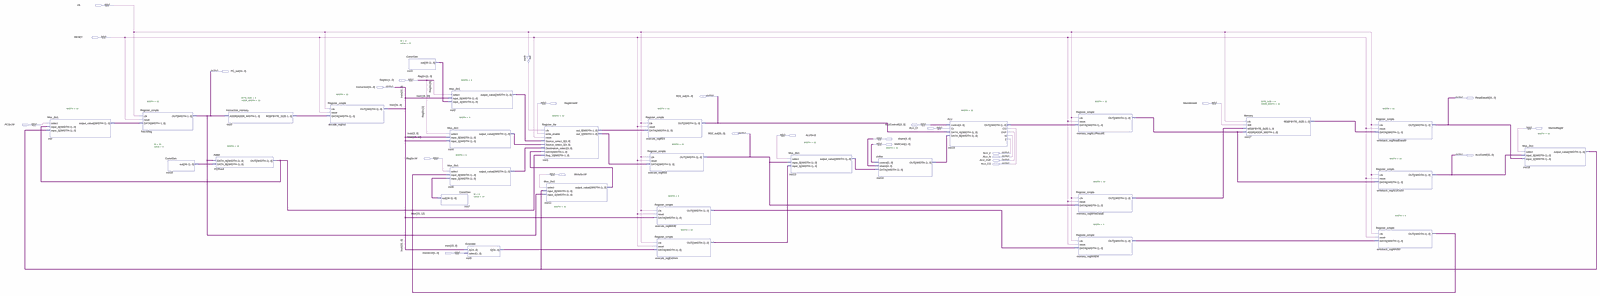
[diagram p0: schematic sheet, whole]
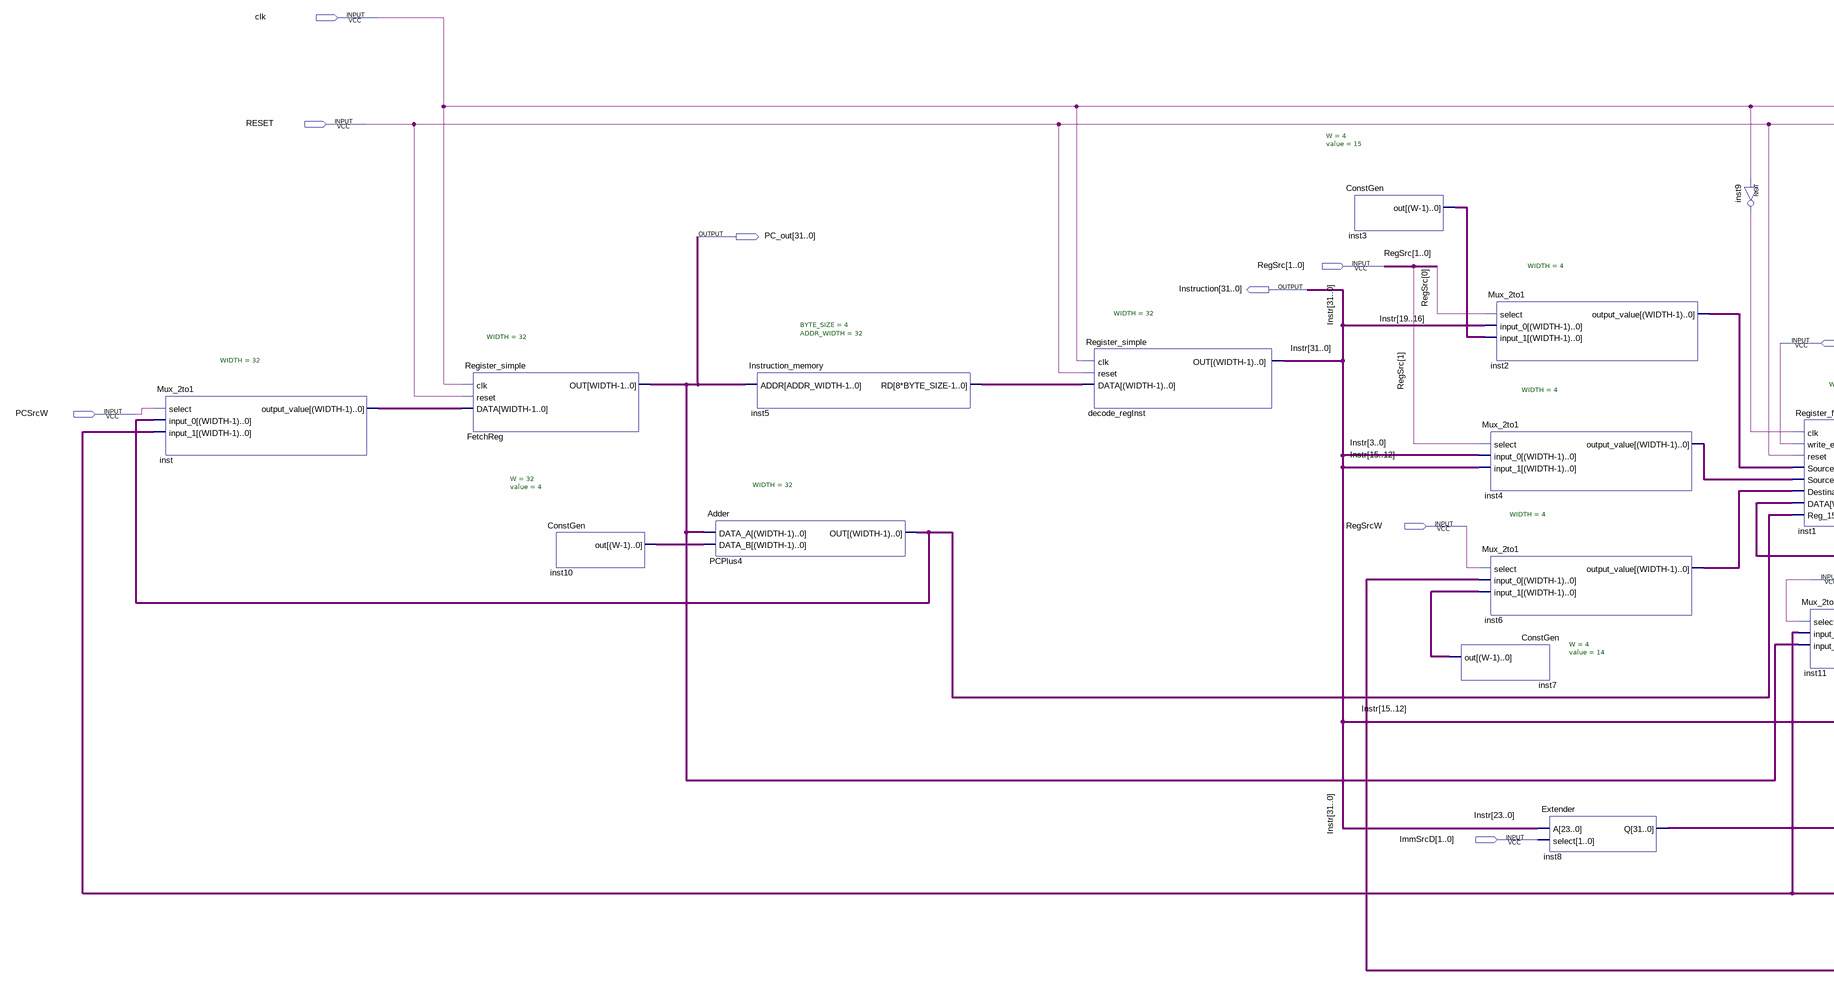
[diagram p1: schematic sheet, left part]
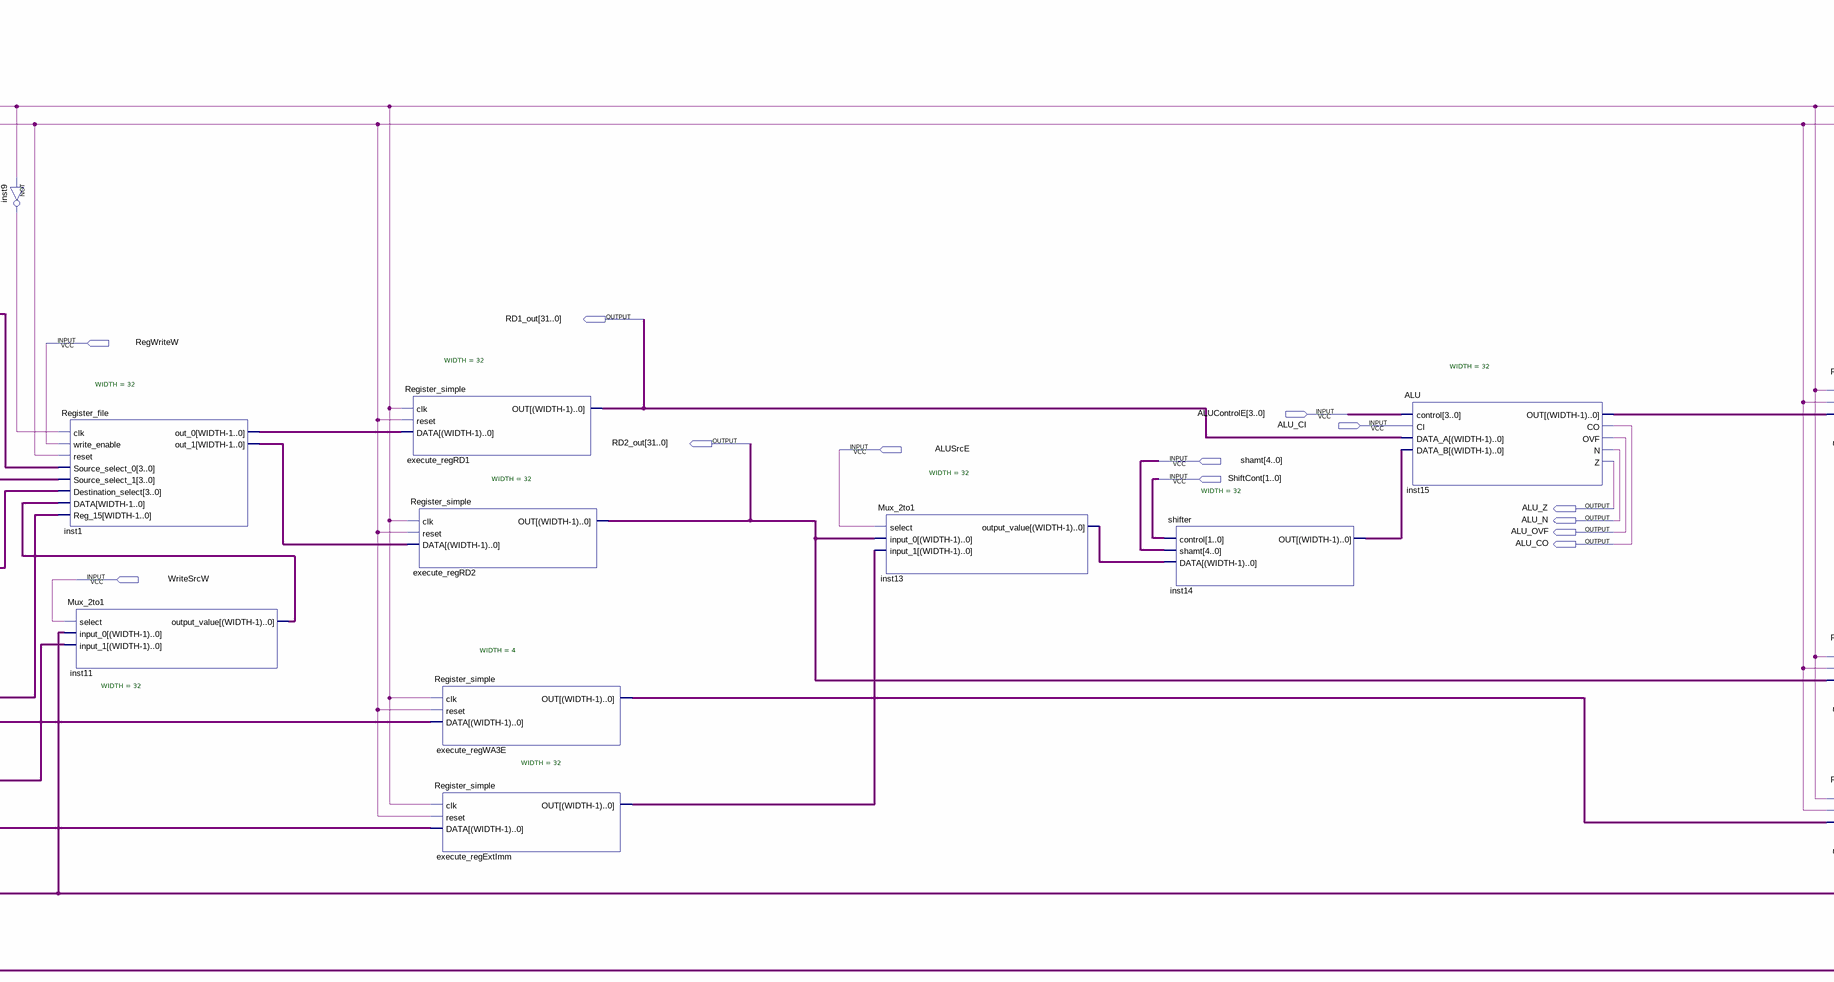
[diagram p2: schematic sheet, centre part]
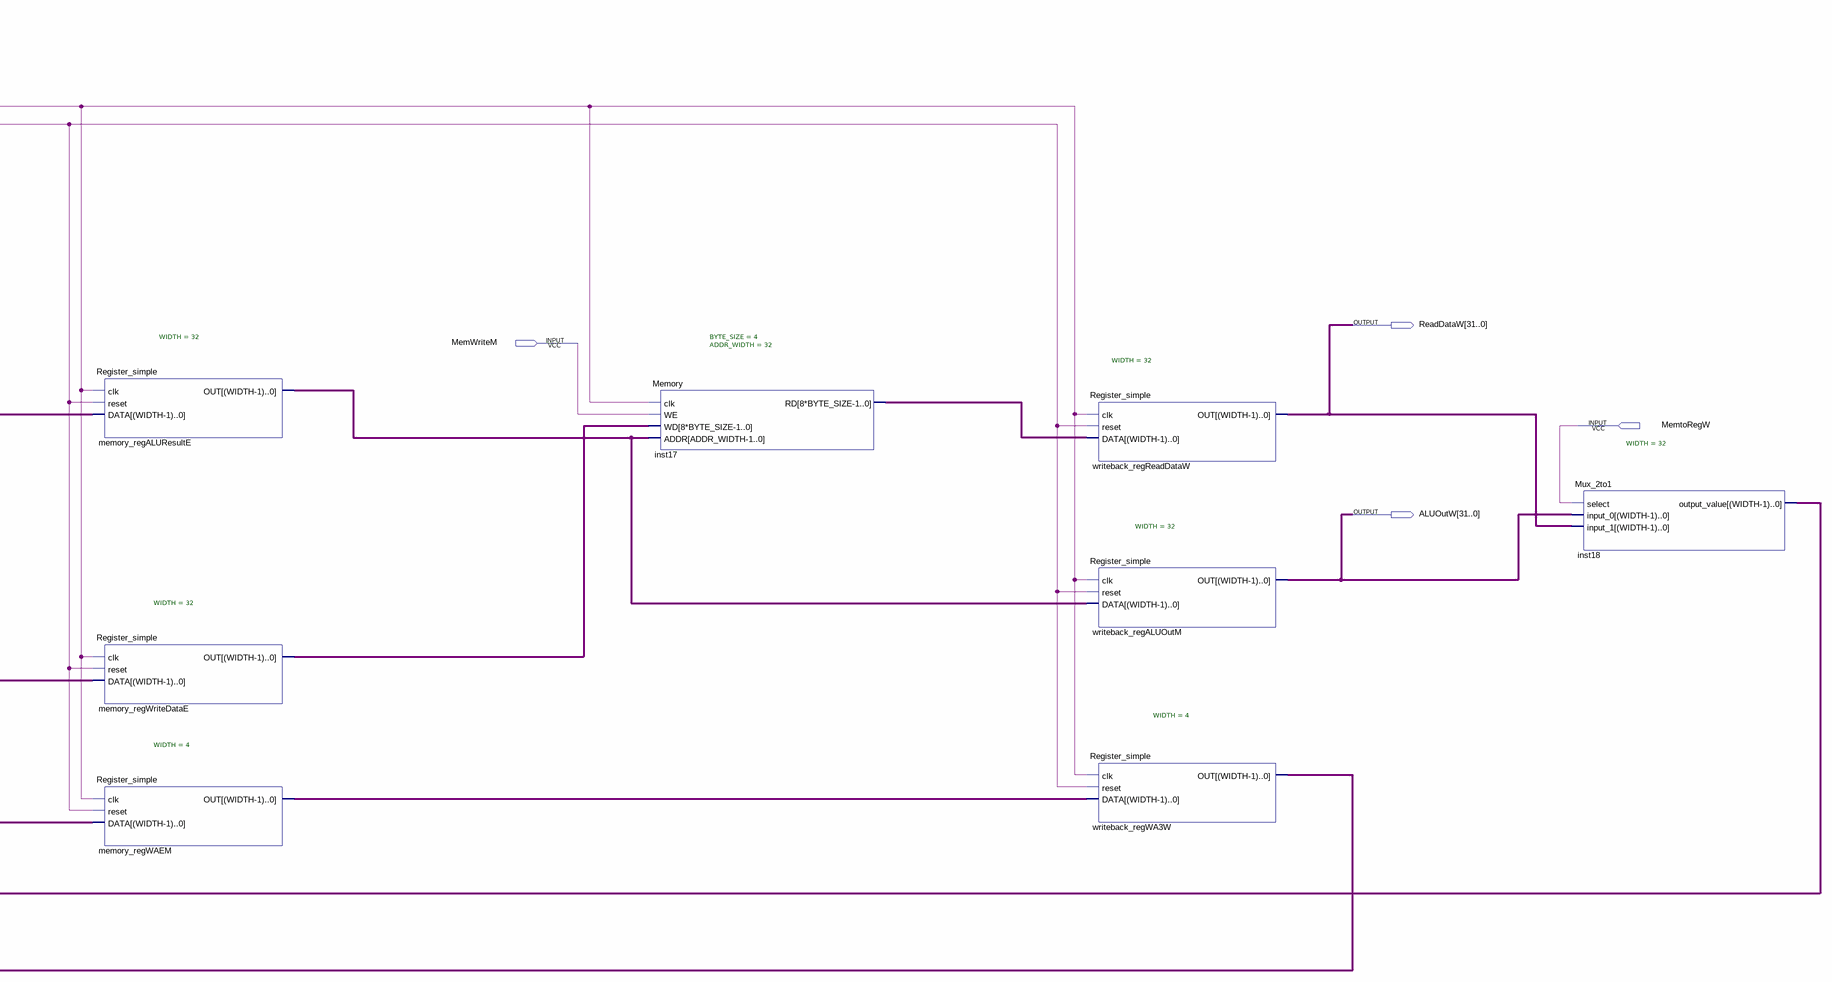
[diagram p3: schematic sheet, right part]
// Quartus schematic datapath.bdf as structural Verilog: 30 symbols, 25 pins
module datapath (
  input  clk,
  input  RESET,
  input  [1:0] RegSrc,
  input  RegWriteW,
  input  MemWriteM,
  input  PCSrcW,
  input  [3:0] ALUControlE,
  input  ALU_CI,
  input  MemtoRegW,
  input  ALUSrcE,
  input  [4:0] shamt,
  input  [1:0] ShiftCont,
  input  RegSrcW,
  input  WriteSrcW,
  input  [1:0] ImmSrcD,
  output [31:0] PC_out,
  output [31:0] Instruction,
  output [31:0] RD1_out,
  output [31:0] ReadDataW,
  output [31:0] RD2_out,
  output ALU_Z,
  output [31:0] ALUOutW,
  output ALU_N,
  output ALU_OVF,
  output ALU_CO
);

  wire inst9_out;
  wire [3:0] execute_regWA3E_out, inst2_output_value, inst3_out, inst4_output_value, inst6_output_value,
       inst7_out, memory_regWAEM_out, writeback_regWA3W_out;
  wire [31:0] execute_regExtImm_out, inst1_out_0, inst1_out_1, inst5_rd, inst8_q, inst10_out,
       inst11_output_value, inst13_output_value, inst14_out, inst15_out, inst17_rd, inst18_output_value,
       inst_output_value, memory_regALUResultE_out, memory_regWriteDataE_out, PCPlus4_out;

  Mux_2to1 #(.WIDTH(32)) inst (
    .select(PCSrcW), .input_0(PCPlus4_out), .input_1(inst18_output_value), .output_value(inst_output_value));
  Register_simple #(.WIDTH(32)) FetchReg (.clk(clk), .reset(RESET), .DATA(inst_output_value), .OUT(PC_out));
  ConstGen #(.W(32), .value(4)) inst10 (.out(inst10_out));
  Adder #(.WIDTH(32)) PCPlus4 (.DATA_A(PC_out), .DATA_B(inst10_out), .OUT(PCPlus4_out));
  Instruction_memory #(.BYTE_SIZE(4), .ADDR_WIDTH(32)) inst5 (.ADDR(PC_out), .RD(inst5_rd));
  Register_simple #(.WIDTH(32)) decode_regInst (.clk(clk), .reset(RESET), .DATA(inst5_rd), .OUT(Instruction));
  ConstGen #(.W(4), .value(15)) inst3 (.out(inst3_out));
  ConstGen #(.W(4), .value(14)) inst7 (.out(inst7_out));
  Mux_2to1 #(.WIDTH(4)) inst2 (
    .select(RegSrc[0]), .input_0(Instruction[19:16]), .input_1(inst3_out), .output_value(inst2_output_value));
  Mux_2to1 #(.WIDTH(4)) inst4 (
    .select(RegSrc[1]), .input_0(Instruction[3:0]), .input_1(Instruction[15:12]),
    .output_value(inst4_output_value));
  Mux_2to1 #(.WIDTH(4)) inst6 (
    .select(RegSrcW), .input_0(writeback_regWA3W_out), .input_1(inst7_out), .output_value(inst6_output_value));
  Extender inst8 (.A(Instruction[23:0]), .select(ImmSrcD), .Q(inst8_q));
  not inst9 (inst9_out, clk);
  Register_file #(.WIDTH(32)) inst1 (
    .clk(inst9_out), .write_enable(RegWriteW), .reset(RESET), .Source_select_0(inst2_output_value),
    .Source_select_1(inst4_output_value), .Destination_select(inst6_output_value),
    .DATA(inst11_output_value), .Reg_15(PCPlus4_out), .out_0(inst1_out_0), .out_1(inst1_out_1));
  Mux_2to1 #(.WIDTH(32)) inst11 (
    .select(WriteSrcW), .input_0(inst18_output_value), .input_1(PC_out), .output_value(inst11_output_value));
  Register_simple #(.WIDTH(32)) execute_regRD1 (.clk(clk), .reset(RESET), .DATA(inst1_out_0), .OUT(RD1_out));
  Register_simple #(.WIDTH(32)) execute_regRD2 (.clk(clk), .reset(RESET), .DATA(inst1_out_1), .OUT(RD2_out));
  Register_simple #(.WIDTH(4)) execute_regWA3E (
    .clk(clk), .reset(RESET), .DATA(Instruction[15:12]), .OUT(execute_regWA3E_out));
  Register_simple #(.WIDTH(32)) execute_regExtImm (
    .clk(clk), .reset(RESET), .DATA(inst8_q), .OUT(execute_regExtImm_out));
  Mux_2to1 #(.WIDTH(32)) inst13 (
    .select(ALUSrcE), .input_0(RD2_out), .input_1(execute_regExtImm_out), .output_value(inst13_output_value));
  shifter #(.WIDTH(32)) inst14 (.control(ShiftCont), .shamt(shamt), .DATA(inst13_output_value), .OUT(inst14_out));
  ALU #(.WIDTH(32)) inst15 (
    .control(ALUControlE), .CI(ALU_CI), .DATA_A(RD1_out), .DATA_B(inst14_out), .OUT(inst15_out), .CO(ALU_CO),
    .OVF(ALU_OVF), .N(ALU_N), .Z(ALU_Z));
  Register_simple #(.WIDTH(32)) memory_regALUResultE (
    .clk(clk), .reset(RESET), .DATA(inst15_out), .OUT(memory_regALUResultE_out));
  Register_simple #(.WIDTH(32)) memory_regWriteDataE (
    .clk(clk), .reset(RESET), .DATA(RD2_out), .OUT(memory_regWriteDataE_out));
  Register_simple #(.WIDTH(4)) memory_regWAEM (
    .clk(clk), .reset(RESET), .DATA(execute_regWA3E_out), .OUT(memory_regWAEM_out));
  Memory #(.BYTE_SIZE(4), .ADDR_WIDTH(32)) inst17 (
    .clk(clk), .WE(MemWriteM), .WD(memory_regWriteDataE_out), .ADDR(memory_regALUResultE_out), .RD(inst17_rd));
  Register_simple #(.WIDTH(32)) writeback_regReadDataW (.clk(clk), .reset(RESET), .DATA(inst17_rd), .OUT(ReadDataW));
  Register_simple #(.WIDTH(32)) writeback_regALUOutM (
    .clk(clk), .reset(RESET), .DATA(memory_regALUResultE_out), .OUT(ALUOutW));
  Register_simple #(.WIDTH(4)) writeback_regWA3W (
    .clk(clk), .reset(RESET), .DATA(memory_regWAEM_out), .OUT(writeback_regWA3W_out));
  Mux_2to1 #(.WIDTH(32)) inst18 (
    .select(MemtoRegW), .input_0(ALUOutW), .input_1(ReadDataW), .output_value(inst18_output_value));

  // Other names for the same wires on the sheet: Instr[31:0] = Instruction
endmodule
